# Altium project EFIS.PrjPCB
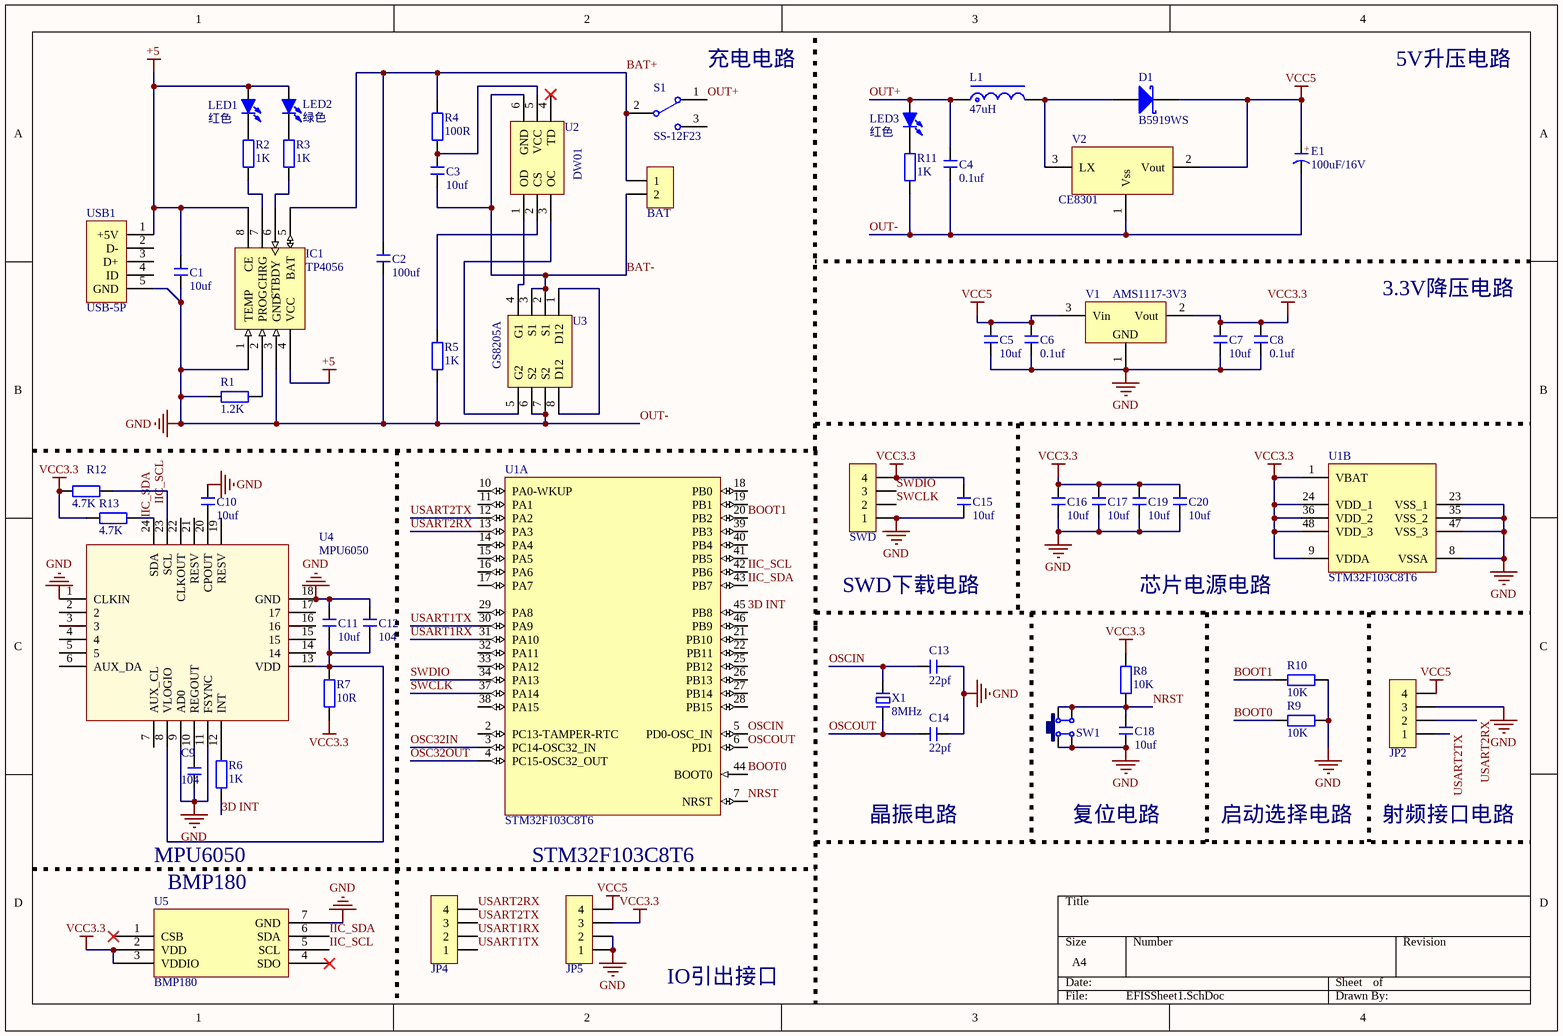
[diagram p0: EFISSheet1.SchDoc]
1 sheet, 56 parts. Net scope: global (net labels, ports and power ports of the same name join across sheets).
Board file: PCB1.PcbDoc

## Sheet EFISSheet1.SchDoc
size A4

### Parts
BAT  HDR-1X2  [XH2.54-LI-2P]  (value not drawn)
C1  10uf  [C 0805_L]
C2  100uf  [C 0805_L]
C3  10uf  [C 0805_L]
C4  0.1uf  [C 0805_L]
C5  10uf  [C 0805_L]
C6  0.1uf  [C 0805_L]
C7  10uf  [C 0805_L]
C8  0.1uf  [C 0805_L]
C9  104  [C 0805_L]
C10  10uf  [C 0805_L]
C11  10uf  [C 0805_L]
C12  104  [C 0805_L]
C13  22pf  [C 0805_L]
C14  22pf  [C 0805_L]
C15  10uf  [C 0805_L]
C16  10uf  [C 0805_L]
C17  10uf  [C 0805_L]
C18  10uf  [C 0805_L]
C19  10uf  [C 0805_L]
C20  10uf  [C 0805_L]
D1  B5919WS  [SOD-323]
E1  100uF/16V  [CM D(6.3*5.4)]
IC1  TP4056  [SOP8_L]
JP2  HDR-1X4  [HDR2.54-LI-4P]  (value not drawn)
JP4  HDR-1X4  [HDR2.54-LI-4P]  (value not drawn)
JP5  HDR-1X4  [HDR2.54-LI-4P]  (value not drawn)
L1  47uH  [CDRH73]
LED1  红色  [LED 0603R]
LED2  绿色  [LED 0603G]
LED3  红色  [LED 0603R]
R1  1.2K  [R 0805_L]
R2  1K  [R 0805_L]
R3  1K  [R 0805_L]
R4  100R  [R 0805_L]
R5  1K  [R 0805_L]
R6  1K  [R 0805_L]
R7  10R  [R 0805_L]
R8  10K  [R 0805_L]
R9  10K  [R 0805_L]
R10  10K  [R 0805_L]
R11  1K  [R 0805_L]
R12  4.7K  [R 0805_L]
R13  4.7K  [R 0805_L]
S1  SS-12F23  [MSK-12C01-07]
SW1  6x6x5  [TSW SMD-6*6*5]  (value not drawn)
SWD  HDR-1X4  [HDR2.54-LI-4P]  (value not drawn)
U1  STM32F103C8T6  [LQFP48_N]  (parts A,B of 2)
U2  DW01  [SOT23-6N]
U3  GS8205A  [SSOP8_N]
U4  MPU6050  [QFN_24]
U5  BMP180  [LGA7]
USB1  USB-5P  [USB-MICRO_A]
V1  AMS1117-3V3  [SOT223_N]
V2  CE8301  [SOT89_N]
X1  8MHz  [OSC HC-49SMD]

### Nets
+5: C1.2 IC1.4(VCC) IC1.8(CE) LED1.1(A) LED2.1(A) USB1.1(+5V)
OUT-: C1.1 C2.1 C4.1 C5.1 C6.1 C7.1 C8.1 C9.1 C10.2 C11.2 C12.2 C13.1 C14.1 C15.1 C16.1 C17.1 C18.1 C19.1 C20.1 E1.2(K) IC1.1(TEMP) IC1.3(GND) JP2.3 JP5.1 JP5.2 R1.1 R5.1 R9.1 R10.2 R11.2 SW1.1 SW1.4 SWD.1 U1.8(VSSA) U1.23(VSS_1) U1.35(VSS_2) U1.47(VSS_3) U3.6(S2) U3.7(S2) U4.1(CLKIN) U4.9(AD0) U4.11(FSYNC) U4.18(GND) U5.7(GND) USB1.5(GND) V1.1(GND) V2.1(Vss)  [also labelled GND]
VCC3.3: C7.2 C8.2 C15.2 C16.2 C17.2 C19.2 C20.2 JP5.3 R7.1 R8.1 R12.1 R13.1 SWD.4 U1.1(VBAT) U1.9(VDDA) U1.24(VDD_1) U1.36(VDD_2) U1.48(VDD_3) U5.2(VDD) U5.3(VDDIO) V1.2(Vout)
VCC5: C5.2 C6.2 D1.2(K) E1.1(A) JP2.4 JP5.4 V1.3(Vin) V2.2(Vout)
3D INT: R6.2 U1.45(PB8)
BAT+: BAT.1 C2.2 IC1.5(BAT) R4.2 S1.2
BAT-: BAT.2 C3.1 U2.6(GND) U3.2(S1) U3.3(S1)
BOOT0: R9.2 U1.44(BOOT0)
BOOT1: R10.1 U1.20(PB2)
IIC_SCL: R12.2 U1.42(PB6) U4.23(SCL) U5.5(SCL)
IIC_SDA: R13.2 U1.43(PB7) U4.24(SDA) U5.6(SDA)
NRST: C18.2 R8.2 SW1.2 SW1.3 U1.7(NRST)
OSC32IN: U1.3(PC14-OSC32_IN)
OSC32OUT: U1.4(PC15-OSC32_OUT)
OSCIN: C13.2 U1.5(PD0-OSC_IN) X1.2
OSCOUT: C14.2 U1.6(PD1) X1.1
OUT+: C4.2 L1.1 LED3.1(A) S1.1
SWCLK: SWD.2 U1.37(PA14)
SWDIO: SWD.3 U1.34(PA13)
USART1RX: JP4.2 U1.31(PA10)
USART1TX: JP4.1 U1.30(PA9)
USART2RX: JP2.2 JP4.4 U1.13(PA3)
USART2TX: JP2.1 JP4.3 U1.12(PA2)
NetC3_2: C3.2 R4.1 U2.5(VCC)
NetC9_2: C9.2 U4.10(REGOUT)
NetC10_1: C10.1 U4.20(CPOUT)
NetC11_1: C11.1 C12.1 R7.2 U4.8(VLOGIO) U4.13(VDD)
NetD1_1: D1.1(A) L1.2 V2.3(LX)
NetIC1_2: IC1.2(PROG) R1.2
NetIC1_6: IC1.6(STBDY) R3.1
NetIC1_7: IC1.7(CHRG) R2.2
NetLED1_2: LED1.2(K) R2.1
NetLED2_2: LED2.2(K) R3.2
NetLED3_2: LED3.2(K) R11.1
NetR5_2: R5.2 U2.2(CS)
NetR6_1: R6.1 U4.12(INT)
NetU2_1: U2.1(OD) U3.4(G1)
NetU2_3: U2.3(OC) U3.5(G2)
NetU3_1: U3.1(D12) U3.8(D12)

Not connected (* = marked no-connect by the designer): S1 3; U1 2(PC13-TAMPER-RTC) 10(PA0-WKUP) 11(PA1) 14(PA4) 15(PA5) 16(PA6) 17(PA7) 18(PB0) 19(PB1) 21(PB10) 22(PB11) 25(PB12) 26(PB13) 27(PB14) 28(PB15) 29(PA8) 32(PA11) 33(PA12) 38(PA15) 39(PB3) 40(PB4) 41(PB5) 46(PB9); U2 4(TD)*; U4 2 3 4 5 6(AUX_DA) 7(AUX_CL) 14 15 16 17 19(RESV) 21(RESV) 22(CLKOUT); U5 1(CSB)* 4(SDO)*; USB1 2(D-) 3(D+) 4(ID)

### Notes on the sheet
- (near S1) 充电电路
- 5V升压电路
- 3.3V降压电路
- SWD下载电路
- 芯片电源电路
- 晶振电路
- 复位电路
- 启动选择电路
- 射频接口电路
- MPU6050
- (near U5) BMP180
- STM32F103C8T6
- IO引出接口
- (in symbol CE_SMD) +

### Library data of the parts
BAT = Header 2: 2P接插件; 版权归属: 封装库来自淘宝 ID：黄晶宝石; BOM名称: 2P接插件; 联系售后: https://shop463601444.taobao.com
C1-C20 = C: 贴片电容; BOM名称: 无极性贴片电容; 淘宝ID: 封装库来自淘宝 ID：黄晶宝石; 联系售后，技术支持: https://shop463601444.taobao.com; 唯一出售店铺网址: https://shop463601444.taobao.com
D1 = 1N5819: 肖特基二极管; 淘宝ID: 封装库来自淘宝 ID：黄晶宝石; 属性: 40V/2A; BOM名称: 肖特基二极管; 欢迎光临: https://shop463601444.taobao.com
E1 = CE_SMD: 贴片电解电容; 版权归属: 封装库来自淘宝 ID：黄晶宝石; BOM名称: 贴片电解电容; 联系售后: https://shop463601444.taobao.com
IC1 = 24Cxx: 外置EEPROM; 版权归属: 封装库来自淘宝 ID：黄晶宝石; BOM名称: 外置EEPROM; 唯一出售店铺网址: https://shop463601444.taobao.com
JP2 JP4 JP5 SWD = Header 4: 4P接插件; 版权归属: 封装库来自淘宝 ID：黄晶宝石; BOM名称: 4P接插件; 学习资源: https://shop463601444.taobao.com
L1 = L-CDRH: 功率屏蔽电感; 版权归属: 封装库来自淘宝 ID：黄晶宝石; BOM名称: 功率屏蔽电感; 联系售后: https://shop463601444.taobao.com
LED1-LED3 = LED-SMD: 贴片LED; 版权归属: 封装库来自淘宝 ID：黄晶宝石; BOM名称: 贴片LED; 学习资源: https://shop463601444.taobao.com
R1-R13 = R: 贴片电阻; 版权归属: 来自淘宝 ID：黄晶宝石; 封装库来自淘宝卖家 ID：黄晶宝石: 其他店铺购入均为盗版，不享受售后技术支持服务，请立即申请退款; BOM名称: 贴片电阻; 联系售后: https://shop463601444.taobao.com
S1 = SSW-1P: 1路波动开关; BOM名称: 波动开关; 版权归属: 封装库来自淘宝 ID：黄晶宝石; 学习资源: https://shop463601444.taobao.com
SW1 = TSW SMD-6x6: 贴片6x6轻触开关; 版权归属: 封装库来自淘宝 ID：黄晶宝石; BOM名称: 贴片6x6轻触开关; 唯一出售店铺网址: https://shop463601444.taobao.com
U1 = STM32F103C8T6: STM32 ARM-based 32-bit MCU Performance Line with 64 kB Flash, 20 kB Internal RAM, -40 to +85癈 Temperature, 48-Pin LQFP, Tray; DatasheetVersion: rev13.0, Apr-2011; PackageVersion: rev13, Apr-2011; PackageReference: LQFP48; PackageDescription: 48-Pin Low-Profile Quad Flat Pack, 7 x 7 mm Body, 0.5 mm Pitch (LQFP48); ComponentLink1Description: Manufacturer URL; ComponentLink1URL: http://www.st.com/; ComponentLink2Description: STM32F103 Datasheet; ComponentLink2URL: http://www.st.com/internet/com/TECHNICAL_RESOURCES/TECHNICAL_LITERATURE/DATASHEET/CD00161566.pdf; ComponentLink3Description: STM32 Family Web Page; ComponentLink3URL: www.st.com/stm32; 联系售后: https://shop463601444.taobao.com
U2 = DW01: 锂电池过流保护IC; BOM名称: 过流保护IC; 淘宝ID: 封装库来自淘宝 ID：黄晶宝石; 欢迎光临: https://shop463601444.taobao.com
U3 = GS8205A: N沟道增强型功率场效应管; BOM名称: 场效应管; 技术支持，联系售后: 封装库来自淘宝卖家 ID：黄晶宝石; 版权归属: 源创客
U4 = MPU6050: 三轴加速度+三轴陀螺仪; 淘宝ID:黄晶宝石: 封装库来自淘宝卖家 ID：黄晶宝石; 封装库来自淘宝卖家 ID：黄晶宝石: 其他店铺购入均为盗版，不享受售后技术支持服务，请立即申请退款; 技术支持，联系售后: https://shop463601444.taobao.com
USB1 = USB-5P: 微型USB母座; BOM名称: 微型USB母座; 学习资源: https://shop463601444.taobao.com
V1 = AMS1117: 三端稳压芯片; BOM名称: 稳压芯片; 淘宝ID: 封装库来自淘宝 ID：黄晶宝石; 欢迎光临淘宝店铺: https://shop463601444.taobao.com
V2 = HT71xx: LDO线性稳压芯片; 版权归属: 封装库来自淘宝 ID：黄晶宝石; BOM名称: LDO线性稳压芯片; 学习资源: https://shop463601444.taobao.com
X1 = XTAL-2P: 2脚无源脚晶振; 版权归属: 封装库来自淘宝卖家 ID：黄晶宝石; BOM名称: 2脚无源脚晶振; 学习资源: https://shop463601444.taobao.com